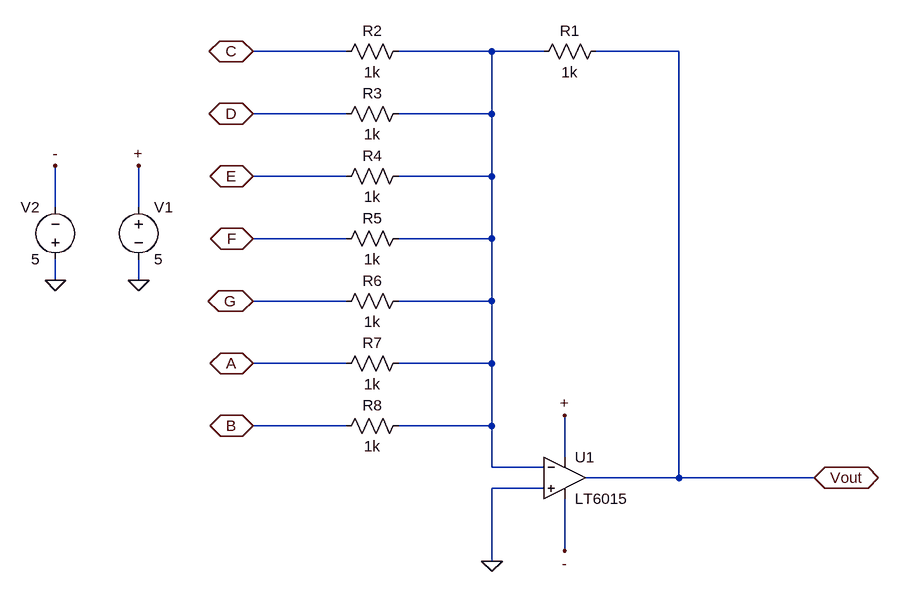
[diagram p0: schematic Summing_amplifier.asc]
Summing_amplifier.asc, the LTspice schematic file:
Version 4
SHEET 1 880 680
WIRE -144 -464 -288 -464
WIRE 80 -464 -64 -464
WIRE 160 -464 80 -464
WIRE 368 -464 240 -464
WIRE -144 -368 -288 -368
WIRE 80 -368 80 -464
WIRE 80 -368 -64 -368
WIRE -144 -272 -288 -272
WIRE 80 -272 80 -368
WIRE 80 -272 -64 -272
WIRE -592 -224 -592 -288
WIRE -464 -224 -464 -288
WIRE -144 -176 -288 -176
WIRE 80 -176 80 -272
WIRE 80 -176 -64 -176
WIRE -592 -112 -592 -144
WIRE -464 -112 -464 -144
WIRE -144 -80 -288 -80
WIRE 80 -80 80 -176
WIRE 80 -80 -64 -80
WIRE -144 16 -288 16
WIRE 80 16 80 -80
WIRE 80 16 -64 16
WIRE -144 112 -288 112
WIRE 80 112 80 16
WIRE 80 112 -64 112
WIRE 192 160 192 96
WIRE 80 176 80 112
WIRE 160 176 80 176
WIRE 368 192 368 -464
WIRE 368 192 224 192
WIRE 576 192 368 192
WIRE 160 208 80 208
WIRE 192 304 192 224
WIRE 80 320 80 208
FLAG 80 320 0
FLAG -464 -112 0
FLAG -592 -112 0
FLAG -464 -288 +
FLAG 192 96 +
FLAG -592 -288 -
FLAG 192 304 -
FLAG 576 192 Vout
IOPIN 576 192 BiDir
FLAG -288 -464 C
IOPIN -288 -464 BiDir
FLAG -288 -368 D
IOPIN -288 -368 BiDir
FLAG -288 -272 E
IOPIN -288 -272 BiDir
FLAG -288 -176 F
IOPIN -288 -176 BiDir
FLAG -288 -80 G
IOPIN -288 -80 BiDir
FLAG -288 16 A
IOPIN -288 16 BiDir
FLAG -288 112 B
IOPIN -288 112 BiDir
SYMBOL Opamps\\LT6015 192 192 R0
SYMATTR InstName U1
SYMBOL res 256 -480 R90
WINDOW 0 0 56 VBottom 2
WINDOW 3 32 56 VTop 2
SYMATTR InstName R1
SYMATTR Value 1k
SYMBOL res -48 -480 R90
WINDOW 0 0 56 VBottom 2
WINDOW 3 32 56 VTop 2
SYMATTR InstName R2
SYMATTR Value 1k
SYMBOL res -48 -384 R90
WINDOW 0 0 56 VBottom 2
WINDOW 3 32 56 VTop 2
SYMATTR InstName R3
SYMATTR Value 1k
SYMBOL res -48 -288 R90
WINDOW 0 0 56 VBottom 2
WINDOW 3 32 56 VTop 2
SYMATTR InstName R4
SYMATTR Value 1k
SYMBOL res -48 -192 R90
WINDOW 0 0 56 VBottom 2
WINDOW 3 32 56 VTop 2
SYMATTR InstName R5
SYMATTR Value 1k
SYMBOL res -48 -96 R90
WINDOW 0 0 56 VBottom 2
WINDOW 3 32 56 VTop 2
SYMATTR InstName R6
SYMATTR Value 1k
SYMBOL res -48 0 R90
WINDOW 0 0 56 VBottom 2
WINDOW 3 32 56 VTop 2
SYMATTR InstName R7
SYMATTR Value 1k
SYMBOL res -48 96 R90
WINDOW 0 0 56 VBottom 2
WINDOW 3 32 56 VTop 2
SYMATTR InstName R8
SYMATTR Value 1k
SYMBOL voltage -464 -240 R0
WINDOW 123 0 0 Left 0
WINDOW 39 0 0 Left 0
SYMATTR InstName V1
SYMATTR Value 5
SYMBOL voltage -592 -128 R180
WINDOW 0 24 96 Left 2
WINDOW 3 24 16 Left 2
WINDOW 123 0 0 Left 0
WINDOW 39 0 0 Left 0
SYMATTR InstName V2
SYMATTR Value 5

The netlist it stands for:
* Summing_amplifier.asc
XU1 0 N001 + - Vout LT6016  ; LT6015, pins In+ In- V+ V- OUT
R1 Vout N001 1k
R2 N001 C 1k
R3 N001 D 1k
R4 N001 E 1k
R5 N001 F 1k
R6 N001 G 1k
R7 N001 A 1k
R8 N001 B 1k
V1 + 0 5
V2 0 - 5
.lib LTC2.lib
.backanno
.end